# EAGLE schematic apu-csk-motherboard (EAGLE 9.6.2)
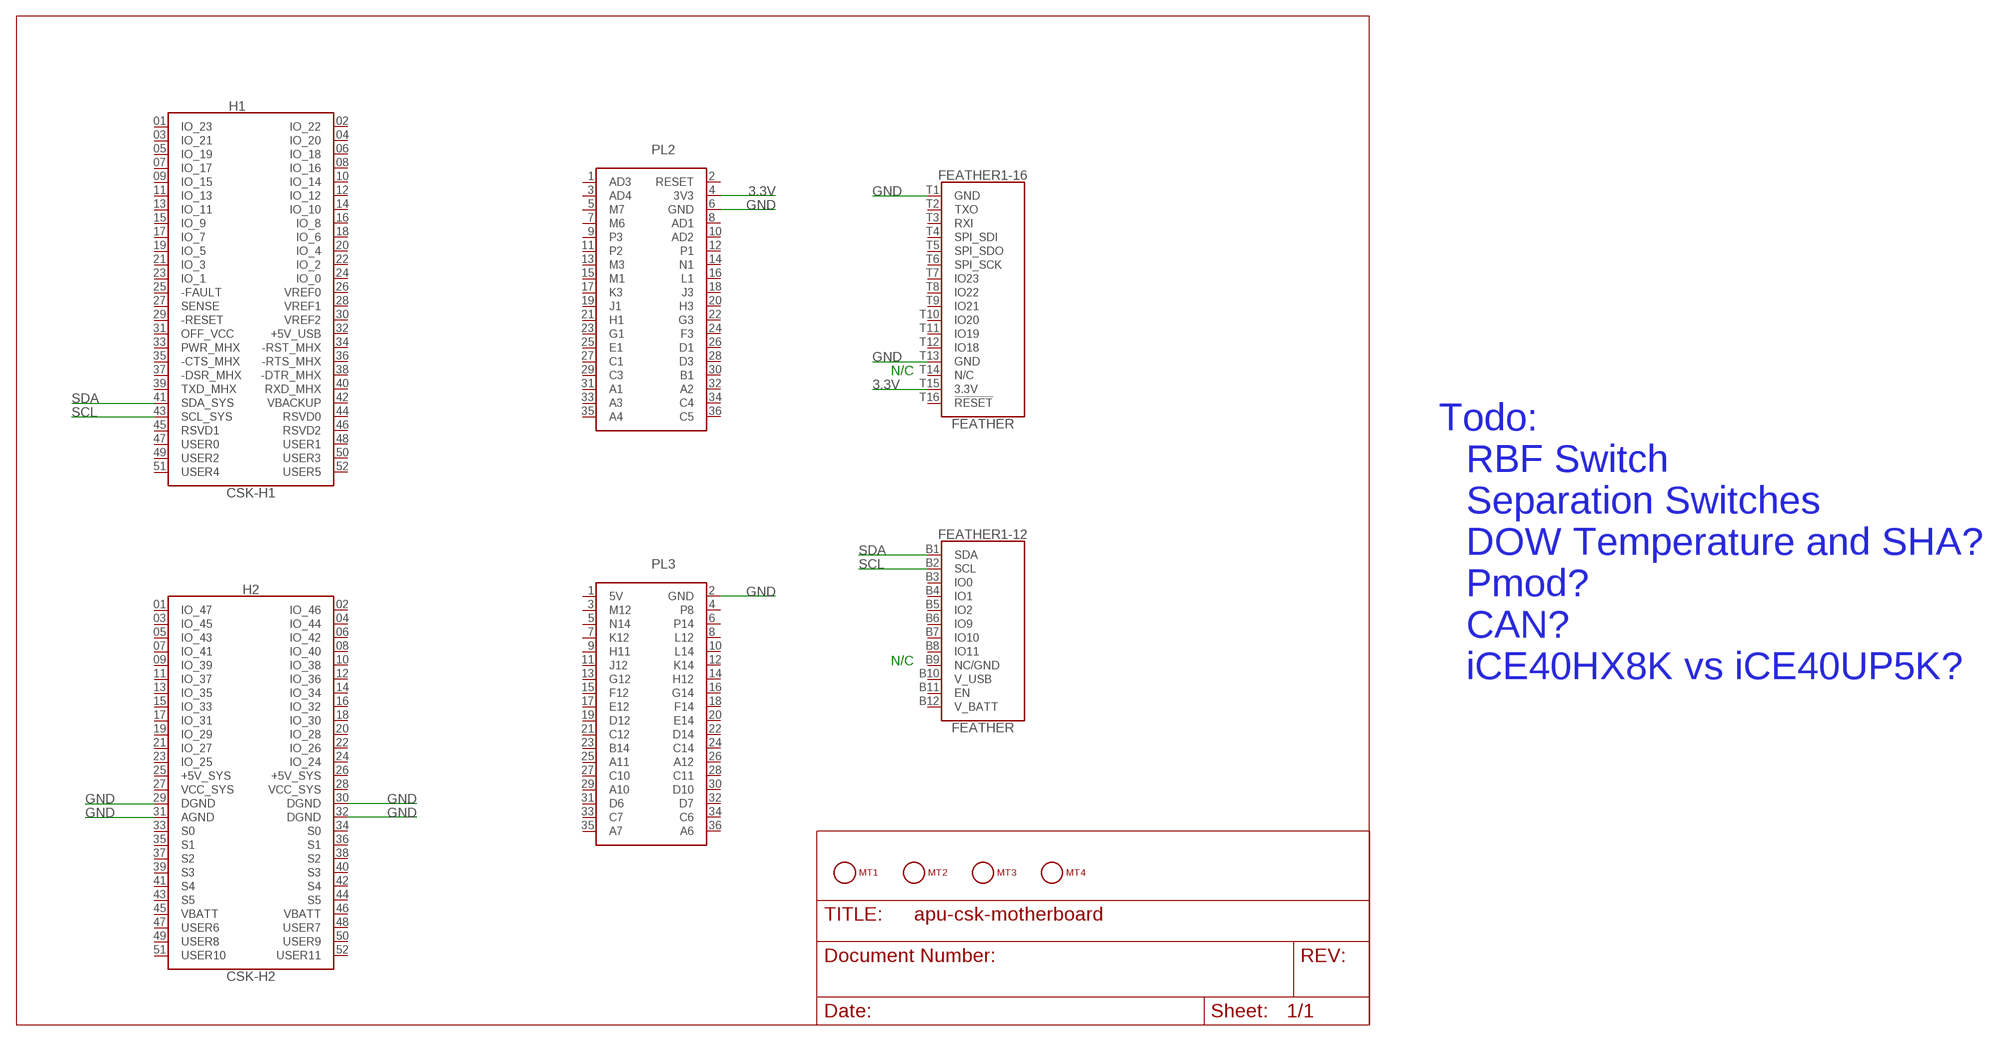
[diagram p0: schematic, sheet 1]

## Parts
FEATHER1  FEATHER  [FEATHER]
H1  CSK-H1  [SAMTEC_ESQ-126-37-G-D--NUMBERED-FOR-CUBESAT-BUS]
H2  CSK-H2  [SAMTEC_ESQ-126-37-G-D--NUMBERED-FOR-CUBESAT-BUS]
MT1  MOUNTING_HOLE-125_250_ROUND  [MT_125_250]
MT2  MOUNTING_HOLE-125_250_ROUND  [MT_125_250]
MT3  MOUNTING_HOLE-125_250_ROUND  [MT_125_250]
MT4  MOUNTING_HOLE-125_250_ROUND  [MT_125_250]
PL2  ICEWERX-PL2  [TE_4-1734506-1]
PL3  ICEWERX-PL3  [TE_4-1734506-1]

## Nets
3.3V: FEATHER1.T15(-16:3.3V) PL2.4(3V3)
GND: FEATHER1.T1(-16:GND) FEATHER1.T13(-16:GND) H2.29(DGND) H2.30(DGND) H2.31(AGND) H2.32(DGND) PL2.6(GND) PL3.2(GND)
SCL: FEATHER1.B2(-12:SCL) H1.43(SCL_SYS)
SDA: FEATHER1.B1(-12:SDA) H1.41(SDA_SYS)
Unconnected: FEATHER1.B3(-12:IO0) FEATHER1.B4(-12:IO1) FEATHER1.B5(-12:IO2) FEATHER1.B6(-12:IO9) FEATHER1.B7(-12:IO10) FEATHER1.B8(-12:IO11) FEATHER1.B9(-12:NC/GND) FEATHER1.B10(-12:V_USB) FEATHER1.B11(-12:EN) FEATHER1.B12(-12:V_BATT) FEATHER1.T2(-16:TXO) FEATHER1.T3(-16:RXI) FEATHER1.T4(-16:SPI_SDI) FEATHER1.T5(-16:SPI_SDO) FEATHER1.T6(-16:SPI_SCK) FEATHER1.T7(-16:IO23) FEATHER1.T8(-16:IO22) FEATHER1.T9(-16:IO21) FEATHER1.T10(-16:IO20) FEATHER1.T11(-16:IO19) FEATHER1.T12(-16:IO18) FEATHER1.T14(-16:N/C) FEATHER1.T16(-16:!RESET) H1.01(IO_23) H1.02(IO_22) H1.03(IO_21) H1.04(IO_20) H1.05(IO_19) H1.06(IO_18) H1.07(IO_17) H1.08(IO_16) H1.09(IO_15) H1.10(IO_14) H1.11(IO_13) H1.12(IO_12) H1.13(IO_11) H1.14(IO_10) H1.15(IO_9) H1.16(IO_8) H1.17(IO_7) H1.18(IO_6) H1.19(IO_5) H1.20(IO_4) H1.21(IO_3) H1.22(IO_2) H1.23(IO_1) H1.24(IO_0) H1.25(-FAULT) H1.26(VREF0) H1.27(SENSE) H1.28(VREF1) H1.29(-RESET) H1.30(VREF2) H1.31(OFF_VCC) H1.32(+5V_USB) H1.33(PWR_MHX) H1.34(-RST_MHX) H1.35(-CTS_MHX) H1.36(-RTS_MHX) H1.37(-DSR_MHX) H1.38(-DTR_MHX) H1.39(TXD_MHX) H1.40(RXD_MHX) H1.42(VBACKUP) H1.44(RSVD0) H1.45(RSVD1) H1.46(RSVD2) H1.47(USER0) H1.48(USER1) H1.49(USER2) H1.50(USER3) H1.51(USER4) H1.52(USER5) H2.01(IO_47) H2.02(IO_46) H2.03(IO_45) H2.04(IO_44) H2.05(IO_43) H2.06(IO_42) H2.07(IO_41) H2.08(IO_40) H2.09(IO_39) H2.10(IO_38) H2.11(IO_37) H2.12(IO_36) H2.13(IO_35) H2.14(IO_34) H2.15(IO_33) H2.16(IO_32) H2.17(IO_31) H2.18(IO_30) H2.19(IO_29) H2.20(IO_28) H2.21(IO_27) H2.22(IO_26) H2.23(IO_25) H2.24(IO_24) H2.25(+5V_SYS) H2.26(+5V_SYS) H2.27(VCC_SYS) H2.28(VCC_SYS) H2.33(S0) H2.34(S0) H2.35(S1) H2.36(S1) H2.37(S2) H2.38(S2) H2.39(S3) H2.40(S3) H2.41(S4) H2.42(S4) H2.43(S5) H2.44(S5) H2.45(VBATT) H2.46(VBATT) H2.47(USER6) H2.48(USER7) H2.49(USER8) H2.50(USER9) H2.51(USER10) H2.52(USER11) MT1.1 MT2.1 MT3.1 MT4.1 PL2.1(AD3) PL2.2(RESET) PL2.3(AD4) PL2.5(M7) PL2.7(M6) PL2.8(AD1) PL2.9(P3) PL2.10(AD2) PL2.11(P2) PL2.12(P1) PL2.13(M3) PL2.14(N1) PL2.15(M1) PL2.16(L1) PL2.17(K3) PL2.18(J3) PL2.19(J1) PL2.20(H3) PL2.21(H1) PL2.22(G3) PL2.23(G1) PL2.24(F3) PL2.25(E1) PL2.26(D1) PL2.27(C1) PL2.28(D3) PL2.29(C3) PL2.30(B1) PL2.31(A1) PL2.32(A2) PL2.33(A3) PL2.34(C4) PL2.35(A4) PL2.36(C5) PL3.1(5V) PL3.3(M12) PL3.4(P8) PL3.5(N14) PL3.6(P14) PL3.7(K12) PL3.8(L12) PL3.9(H11) PL3.10(L14) PL3.11(J12) PL3.12(K14) PL3.13(G12) PL3.14(H12) PL3.15(F12) PL3.16(G14) PL3.17(E12) PL3.18(F14) PL3.19(D12) PL3.20(E14) PL3.21(C12) PL3.22(D14) PL3.23(B14) PL3.24(C14) PL3.25(A11) PL3.26(A12) PL3.27(C10) PL3.28(C11) PL3.29(A10) PL3.30(D10) PL3.31(D6) PL3.32(D7) PL3.33(C7) PL3.34(C6) PL3.35(A7) PL3.36(A6)

## Notes on the sheet
- N/C
- Todo:
- RBF Switch
- Separation Switches
- DOW Temperature and SHA?
- Pmod?
- CAN?
- N/C
- iCE40HX8K vs iCE40UP5K?

## Library data of the parts
FEATHER1 = apu-csk-motherboard:FEATHER
H1 = apu-csk-motherboard:CSK-H1
H2 = apu-csk-motherboard:CSK-H2
MT1-MT4 = apu-csk-motherboard:MOUNTING_HOLE
PL2 = apu-csk-motherboard:ICEWERX-PL2
PL3 = apu-csk-motherboard:ICEWERX-PL3